# EAGLE design Ronin (EAGLE 8.3.1)

## Sheet 1 of 2
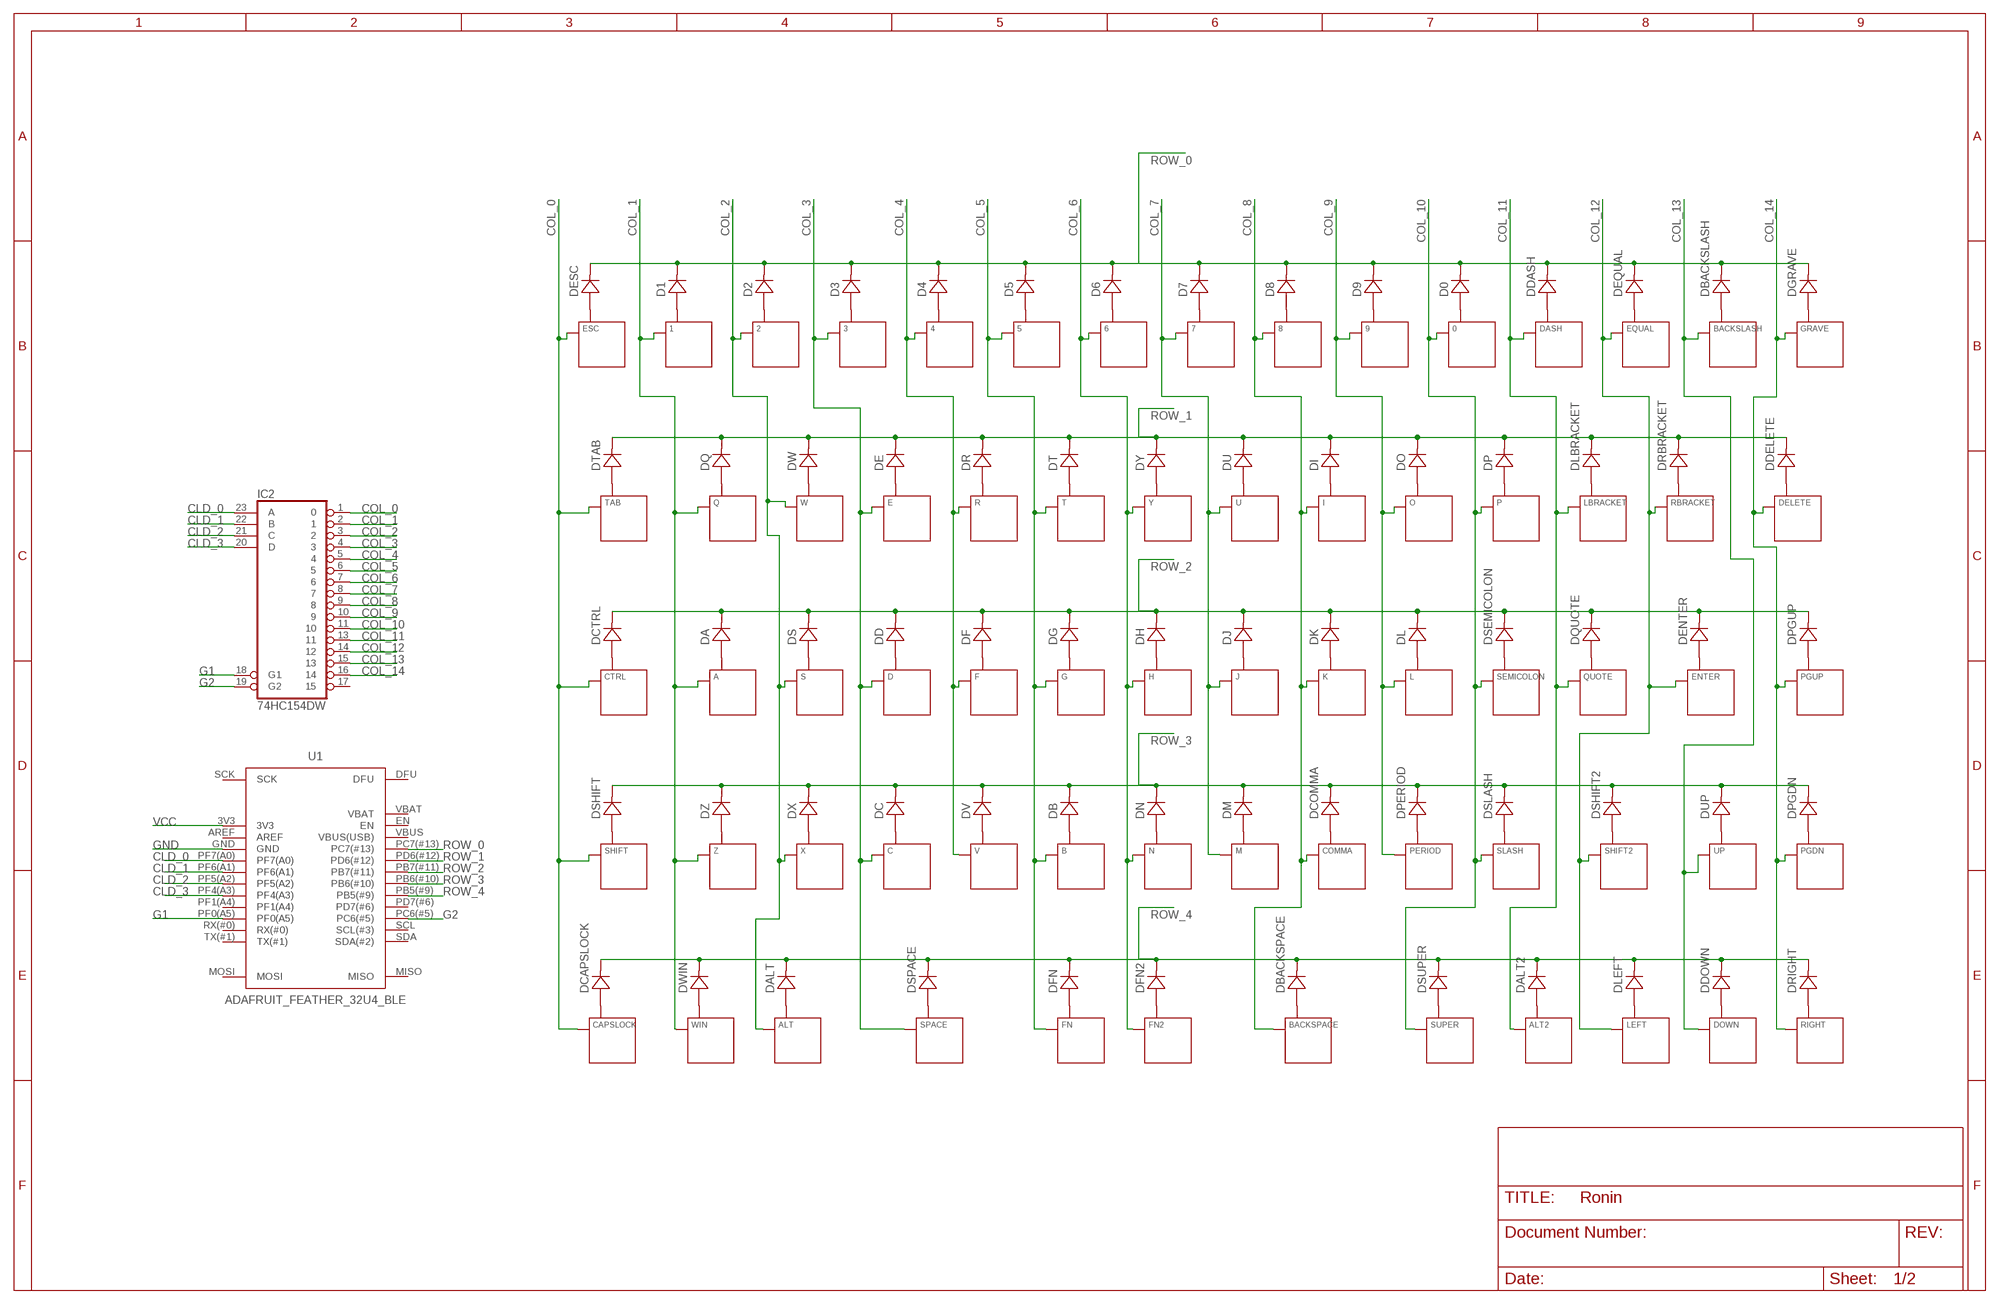
[diagram p0: schematic, sheet 1]

### Parts
0  KEYSWITCH-PLAIN-ALPSMX-1U  [ALPSMX-1U]
1  KEYSWITCH-PLAIN-ALPSMX-1U  [ALPSMX-1U]
2  KEYSWITCH-PLAIN-ALPSMX-1U  [ALPSMX-1U]
3  KEYSWITCH-PLAIN-ALPSMX-1U  [ALPSMX-1U]
4  KEYSWITCH-PLAIN-ALPSMX-1U  [ALPSMX-1U]
5  KEYSWITCH-PLAIN-ALPSMX-1U  [ALPSMX-1U]
6  KEYSWITCH-PLAIN-ALPSMX-1U  [ALPSMX-1U]
7  KEYSWITCH-PLAIN-ALPSMX-1U  [ALPSMX-1U]
8  KEYSWITCH-PLAIN-ALPSMX-1U  [ALPSMX-1U]
9  KEYSWITCH-PLAIN-ALPSMX-1U  [ALPSMX-1U]
A  KEYSWITCH-PLAIN-ALPSMX-1U  [ALPSMX-1U]
ALT  KEYSWITCH-PLAIN-ALPSMX-1U  [ALPSMX-1U]
ALT2  KEYSWITCH-PLAIN-ALPSMX-1U  [ALPSMX-1U]
B  KEYSWITCH-PLAIN-ALPSMX-1U  [ALPSMX-1U]
BACKSLASH  KEYSWITCH-PLAIN-ALPSMX-1U  [ALPSMX-1U]
BACKSPACE  KEYSWITCH-PLAIN-ALPSMX-2U  [ALPSMX-2U]
C  KEYSWITCH-PLAIN-ALPSMX-1U  [ALPSMX-1U]
CAPSLOCK  KEYSWITCH-PLAIN-ALPSMX-1U  [ALPSMX-1U]
COMMA  KEYSWITCH-PLAIN-ALPSMX-1U  [ALPSMX-1U]
CTRL  KEYSWITCH-PLAIN-ALPSMX-1U  [ALPSMX-1U]
D  KEYSWITCH-PLAIN-ALPSMX-1U  [ALPSMX-1U]
D0  DIODE-SOD-123  [SOD-123]
D1  DIODE-SOD-123  [SOD-123]
D2  DIODE-SOD-123  [SOD-123]
D3  DIODE-SOD-123  [SOD-123]
D4  DIODE-SOD-123  [SOD-123]
D5  DIODE-SOD-123  [SOD-123]
D6  DIODE-SOD-123  [SOD-123]
D7  DIODE-SOD-123  [SOD-123]
D8  DIODE-SOD-123  [SOD-123]
D9  DIODE-SOD-123  [SOD-123]
DA  DIODE-SOD-123  [SOD-123]
DALT  DIODE-SOD-123  [SOD-123]
DALT2  DIODE-SOD-123  [SOD-123]
DASH  KEYSWITCH-PLAIN-ALPSMX-1U  [ALPSMX-1U]
DB  DIODE-SOD-123  [SOD-123]
DBACKSLASH  DIODE-SOD-123  [SOD-123]
DBACKSPACE  DIODE-SOD-123  [SOD-123]
DC  DIODE-SOD-123  [SOD-123]
DCAPSLOCK  DIODE-SOD-123  [SOD-123]
DCOMMA  DIODE-SOD-123  [SOD-123]
DCTRL  DIODE-SOD-123  [SOD-123]
DD  DIODE-SOD-123  [SOD-123]
DDASH  DIODE-SOD-123  [SOD-123]
DDELETE  DIODE-SOD-123  [SOD-123]
DDOWN  DIODE-SOD-123  [SOD-123]
DE  DIODE-SOD-123  [SOD-123]
DELETE  KEYSWITCH-PLAIN-ALPSMX-1U  [ALPSMX-1U]
DENTER  DIODE-SOD-123  [SOD-123]
DEQUAL  DIODE-SOD-123  [SOD-123]
DESC  DIODE-SOD-123  [SOD-123]
DF  DIODE-SOD-123  [SOD-123]
DFN  DIODE-SOD-123  [SOD-123]
DFN2  DIODE-SOD-123  [SOD-123]
DG  DIODE-SOD-123  [SOD-123]
DGRAVE  DIODE-SOD-123  [SOD-123]
DH  DIODE-SOD-123  [SOD-123]
DI  DIODE-SOD-123  [SOD-123]
DJ  DIODE-SOD-123  [SOD-123]
DK  DIODE-SOD-123  [SOD-123]
DL  DIODE-SOD-123  [SOD-123]
DLBRACKET  DIODE-SOD-123  [SOD-123]
DLEFT  DIODE-SOD-123  [SOD-123]
DM  DIODE-SOD-123  [SOD-123]
DN  DIODE-SOD-123  [SOD-123]
DO  DIODE-SOD-123  [SOD-123]
DOWN  KEYSWITCH-PLAIN-ALPSMX-1U  [ALPSMX-1U]
DP  DIODE-SOD-123  [SOD-123]
DPERIOD  DIODE-SOD-123  [SOD-123]
DPGDN  DIODE-SOD-123  [SOD-123]
DPGUP  DIODE-SOD-123  [SOD-123]
DQ  DIODE-SOD-123  [SOD-123]
DQUOTE  DIODE-SOD-123  [SOD-123]
DR  DIODE-SOD-123  [SOD-123]
DRBRACKET  DIODE-SOD-123  [SOD-123]
DRIGHT  DIODE-SOD-123  [SOD-123]
DS  DIODE-SOD-123  [SOD-123]
DSEMICOLON  DIODE-SOD-123  [SOD-123]
DSHIFT  DIODE-SOD-123  [SOD-123]
DSHIFT2  DIODE-SOD-123  [SOD-123]
DSLASH  DIODE-SOD-123  [SOD-123]
DSPACE  DIODE-SOD-123  [SOD-123]
DSUPER  DIODE-SOD-123  [SOD-123]
DT  DIODE-SOD-123  [SOD-123]
DTAB  DIODE-SOD-123  [SOD-123]
DU  DIODE-SOD-123  [SOD-123]
DUP  DIODE-SOD-123  [SOD-123]
DV  DIODE-SOD-123  [SOD-123]
DW  DIODE-SOD-123  [SOD-123]
DWIN  DIODE-SOD-123  [SOD-123]
DX  DIODE-SOD-123  [SOD-123]
DY  DIODE-SOD-123  [SOD-123]
DZ  DIODE-SOD-123  [SOD-123]
E  KEYSWITCH-PLAIN-ALPSMX-1U  [ALPSMX-1U]
ENTER  KEYSWITCH-PLAIN-ALPSMX-1U  [ALPSMX-1U]
EQUAL  KEYSWITCH-PLAIN-ALPSMX-1U  [ALPSMX-1U]
ESC  KEYSWITCH-PLAIN-ALPSMX-1U  [ALPSMX-1U]
F  KEYSWITCH-PLAIN-ALPSMX-1U  [ALPSMX-1U]
FN  KEYSWITCH-PLAIN-ALPSMX-1U  [ALPSMX-1U]
FN2  KEYSWITCH-PLAIN-ALPSMX-1U  [ALPSMX-1U]
G  KEYSWITCH-PLAIN-ALPSMX-1U  [ALPSMX-1U]
GRAVE  KEYSWITCH-PLAIN-ALPSMX-1U  [ALPSMX-1U]
H  KEYSWITCH-PLAIN-ALPSMX-1U  [ALPSMX-1U]
I  KEYSWITCH-PLAIN-ALPSMX-1U  [ALPSMX-1U]
IC2  74HC154DW  [SO24W]
J  KEYSWITCH-PLAIN-ALPSMX-1U  [ALPSMX-1U]
K  KEYSWITCH-PLAIN-ALPSMX-1U  [ALPSMX-1U]
L  KEYSWITCH-PLAIN-ALPSMX-1U  [ALPSMX-1U]
LBRACKET  KEYSWITCH-PLAIN-ALPSMX-1U  [ALPSMX-1U]
LEFT  KEYSWITCH-PLAIN-ALPSMX-1U  [ALPSMX-1U]
M  KEYSWITCH-PLAIN-ALPSMX-1U  [ALPSMX-1U]
N  KEYSWITCH-PLAIN-ALPSMX-1U  [ALPSMX-1U]
O  KEYSWITCH-PLAIN-ALPSMX-1U  [ALPSMX-1U]
P  KEYSWITCH-PLAIN-ALPSMX-1U  [ALPSMX-1U]
PERIOD  KEYSWITCH-PLAIN-ALPSMX-1U  [ALPSMX-1U]
PGDN  KEYSWITCH-PLAIN-ALPSMX-1U  [ALPSMX-1U]
PGUP  KEYSWITCH-PLAIN-ALPSMX-1U  [ALPSMX-1U]
Q  KEYSWITCH-PLAIN-ALPSMX-1U  [ALPSMX-1U]
QUOTE  KEYSWITCH-PLAIN-ALPSMX-1U  [ALPSMX-1U]
R  KEYSWITCH-PLAIN-ALPSMX-1U  [ALPSMX-1U]
RBRACKET  KEYSWITCH-PLAIN-ALPSMX-1U  [ALPSMX-1U]
RIGHT  KEYSWITCH-PLAIN-ALPSMX-1U  [ALPSMX-1U]
S  KEYSWITCH-PLAIN-ALPSMX-1U  [ALPSMX-1U]
SEMICOLON  KEYSWITCH-PLAIN-ALPSMX-1U  [ALPSMX-1U]
SHIFT  KEYSWITCH-PLAIN-ALPSMX-1U  [ALPSMX-1U]
SHIFT2  KEYSWITCH-PLAIN-ALPSMX-1U  [ALPSMX-1U]
SLASH  KEYSWITCH-PLAIN-ALPSMX-1U  [ALPSMX-1U]
SPACE  KEYSWITCH-PLAIN-ALPSMX-2U  [ALPSMX-2U]
SUPER  KEYSWITCH-PLAIN-ALPSMX-1U  [ALPSMX-1U]
T  KEYSWITCH-PLAIN-ALPSMX-1U  [ALPSMX-1U]
TAB  KEYSWITCH-PLAIN-ALPSMX-1U  [ALPSMX-1U]
U  KEYSWITCH-PLAIN-ALPSMX-1U  [ALPSMX-1U]
U1  ADAFRUIT_FEATHER_32U4_BLE  [ADAFRUIT_FEATHER_32U4_BLUEFRUIT]
UP  KEYSWITCH-PLAIN-ALPSMX-1U  [ALPSMX-1U]
V  KEYSWITCH-PLAIN-ALPSMX-1U  [ALPSMX-1U]
W  KEYSWITCH-PLAIN-ALPSMX-1U  [ALPSMX-1U]
WIN  KEYSWITCH-PLAIN-ALPSMX-1U  [ALPSMX-1U]
X  KEYSWITCH-PLAIN-ALPSMX-1U  [ALPSMX-1U]
Y  KEYSWITCH-PLAIN-ALPSMX-1U  [ALPSMX-1U]
Z  KEYSWITCH-PLAIN-ALPSMX-1U  [ALPSMX-1U]

### Nets
CLD_0: IC2.23(A) U1.PF7(A0)
CLD_1: IC2.22(B) U1.PF6(A1)
CLD_2: IC2.21(C) U1.PF5(A2)
CLD_3: IC2.20(D) U1.PF4(A3)
COL_0: CAPSLOCK.ALPS1(P0) CAPSLOCK.MX1(P0) CTRL.ALPS1(P0) CTRL.MX1(P0) ESC.ALPS1(P0) ESC.MX1(P0) IC2.1 SHIFT.ALPS1(P0) SHIFT.MX1(P0) TAB.ALPS1(P0) TAB.MX1(P0)
COL_1: 1.ALPS1(P0) 1.MX1(P0) A.ALPS1(P0) A.MX1(P0) IC2.2 Q.ALPS1(P0) Q.MX1(P0) WIN.ALPS1(P0) WIN.MX1(P0) Z.ALPS1(P0) Z.MX1(P0)
COL_2: 2.ALPS1(P0) 2.MX1(P0) ALT.ALPS1(P0) ALT.MX1(P0) IC2.3 S.ALPS1(P0) S.MX1(P0) W.ALPS1(P0) W.MX1(P0) X.ALPS1(P0) X.MX1(P0)
COL_3: 3.ALPS1(P0) 3.MX1(P0) C.ALPS1(P0) C.MX1(P0) D.ALPS1(P0) D.MX1(P0) E.ALPS1(P0) E.MX1(P0) IC2.4 SPACE.ALPS1(P0) SPACE.MX1(P0)
COL_4: 4.ALPS1(P0) 4.MX1(P0) F.ALPS1(P0) F.MX1(P0) IC2.5 R.ALPS1(P0) R.MX1(P0) V.ALPS1(P0) V.MX1(P0)
COL_5: 5.ALPS1(P0) 5.MX1(P0) B.ALPS1(P0) B.MX1(P0) FN.ALPS1(P0) FN.MX1(P0) G.ALPS1(P0) G.MX1(P0) IC2.6 T.ALPS1(P0) T.MX1(P0)
COL_6: 6.ALPS1(P0) 6.MX1(P0) FN2.ALPS1(P0) FN2.MX1(P0) H.ALPS1(P0) H.MX1(P0) IC2.7 N.ALPS1(P0) N.MX1(P0) Y.ALPS1(P0) Y.MX1(P0)
COL_7: 7.ALPS1(P0) 7.MX1(P0) IC2.8 J.ALPS1(P0) J.MX1(P0) M.ALPS1(P0) M.MX1(P0) U.ALPS1(P0) U.MX1(P0)
COL_8: 8.ALPS1(P0) 8.MX1(P0) BACKSPACE.ALPS1(P0) BACKSPACE.MX1(P0) COMMA.ALPS1(P0) COMMA.MX1(P0) I.ALPS1(P0) I.MX1(P0) IC2.9 K.ALPS1(P0) K.MX1(P0)
COL_9: 9.ALPS1(P0) 9.MX1(P0) IC2.10 L.ALPS1(P0) L.MX1(P0) O.ALPS1(P0) O.MX1(P0) PERIOD.ALPS1(P0) PERIOD.MX1(P0)
COL_10: 0.ALPS1(P0) 0.MX1(P0) IC2.11 P.ALPS1(P0) P.MX1(P0) SEMICOLON.ALPS1(P0) SEMICOLON.MX1(P0) SLASH.ALPS1(P0) SLASH.MX1(P0) SUPER.ALPS1(P0) SUPER.MX1(P0)
COL_11: ALT2.ALPS1(P0) ALT2.MX1(P0) DASH.ALPS1(P0) DASH.MX1(P0) IC2.13 LBRACKET.ALPS1(P0) LBRACKET.MX1(P0) QUOTE.ALPS1(P0) QUOTE.MX1(P0)
COL_12: ENTER.ALPS1(P0) ENTER.MX1(P0) EQUAL.ALPS1(P0) EQUAL.MX1(P0) IC2.14 LEFT.ALPS1(P0) LEFT.MX1(P0) RBRACKET.ALPS1(P0) RBRACKET.MX1(P0) SHIFT2.ALPS1(P0) SHIFT2.MX1(P0)
COL_13: BACKSLASH.ALPS1(P0) BACKSLASH.MX1(P0) DOWN.ALPS1(P0) DOWN.MX1(P0) IC2.15 UP.ALPS1(P0) UP.MX1(P0)
COL_14: DELETE.ALPS1(P0) DELETE.MX1(P0) GRAVE.ALPS1(P0) GRAVE.MX1(P0) IC2.16 PGDN.ALPS1(P0) PGDN.MX1(P0) PGUP.ALPS1(P0) PGUP.MX1(P0) RIGHT.ALPS1(P0) RIGHT.MX1(P0)
G1: IC2.18(G1) U1.PF0(A5)
G2: IC2.19(G2) U1.PC6(#5)
GND: U1.GND
N$1: DESC.A ESC.ALPS2(P1) ESC.MX2(P1)
N$2: 1.ALPS2(P1) 1.MX2(P1) D1.A
N$3: 2.ALPS2(P1) 2.MX2(P1) D2.A
N$4: 3.ALPS2(P1) 3.MX2(P1) D3.A
N$5: 4.ALPS2(P1) 4.MX2(P1) D4.A
N$6: 5.ALPS2(P1) 5.MX2(P1) D5.A
N$7: 6.ALPS2(P1) 6.MX2(P1) D6.A
N$8: 7.ALPS2(P1) 7.MX2(P1) D7.A
N$9: 8.ALPS2(P1) 8.MX2(P1) D8.A
N$10: 9.ALPS2(P1) 9.MX2(P1) D9.A
N$11: 0.ALPS2(P1) 0.MX2(P1) D0.A
N$12: DASH.ALPS2(P1) DASH.MX2(P1) DDASH.A
N$13: DEQUAL.A EQUAL.ALPS2(P1) EQUAL.MX2(P1)
N$14: BACKSLASH.ALPS2(P1) BACKSLASH.MX2(P1) DBACKSLASH.A
N$15: DGRAVE.A GRAVE.ALPS2(P1) GRAVE.MX2(P1)
N$16: DTAB.A TAB.ALPS2(P1) TAB.MX2(P1)
N$17: DQ.A Q.ALPS2(P1) Q.MX2(P1)
N$18: DW.A W.ALPS2(P1) W.MX2(P1)
N$19: DE.A E.ALPS2(P1) E.MX2(P1)
N$20: DR.A R.ALPS2(P1) R.MX2(P1)
N$21: DT.A T.ALPS2(P1) T.MX2(P1)
N$22: DY.A Y.ALPS2(P1) Y.MX2(P1)
N$23: DU.A U.ALPS2(P1) U.MX2(P1)
N$24: DI.A I.ALPS2(P1) I.MX2(P1)
N$25: DO.A O.ALPS2(P1) O.MX2(P1)
N$26: DP.A P.ALPS2(P1) P.MX2(P1)
N$27: DLBRACKET.A LBRACKET.ALPS2(P1) LBRACKET.MX2(P1)
N$28: DRBRACKET.A RBRACKET.ALPS2(P1) RBRACKET.MX2(P1)
N$29: DDELETE.A DELETE.ALPS2(P1) DELETE.MX2(P1)
N$30: CTRL.ALPS2(P1) CTRL.MX2(P1) DCTRL.A
N$31: A.ALPS2(P1) A.MX2(P1) DA.A
N$32: DS.A S.ALPS2(P1) S.MX2(P1)
N$33: D.ALPS2(P1) D.MX2(P1) DD.A
N$34: DF.A F.ALPS2(P1) F.MX2(P1)
N$35: DG.A G.ALPS2(P1) G.MX2(P1)
N$36: DH.A H.ALPS2(P1) H.MX2(P1)
N$37: DJ.A J.ALPS2(P1) J.MX2(P1)
N$38: DK.A K.ALPS2(P1) K.MX2(P1)
N$39: DL.A L.ALPS2(P1) L.MX2(P1)
N$40: DSEMICOLON.A SEMICOLON.ALPS2(P1) SEMICOLON.MX2(P1)
N$41: DQUOTE.A QUOTE.ALPS2(P1) QUOTE.MX2(P1)
N$42: DENTER.A ENTER.ALPS2(P1) ENTER.MX2(P1)
N$43: DPGUP.A PGUP.ALPS2(P1) PGUP.MX2(P1)
N$44: DSHIFT.A SHIFT.ALPS2(P1) SHIFT.MX2(P1)
N$45: DZ.A Z.ALPS2(P1) Z.MX2(P1)
N$46: DX.A X.ALPS2(P1) X.MX2(P1)
N$47: C.ALPS2(P1) C.MX2(P1) DC.A
N$48: DV.A V.ALPS2(P1) V.MX2(P1)
N$49: B.ALPS2(P1) B.MX2(P1) DB.A
N$50: DN.A N.ALPS2(P1) N.MX2(P1)
N$51: DM.A M.ALPS2(P1) M.MX2(P1)
N$52: COMMA.ALPS2(P1) COMMA.MX2(P1) DCOMMA.A
N$53: DPERIOD.A PERIOD.ALPS2(P1) PERIOD.MX2(P1)
N$54: DSLASH.A SLASH.ALPS2(P1) SLASH.MX2(P1)
N$55: DSHIFT2.A SHIFT2.ALPS2(P1) SHIFT2.MX2(P1)
N$56: DUP.A UP.ALPS2(P1) UP.MX2(P1)
N$57: DPGDN.A PGDN.ALPS2(P1) PGDN.MX2(P1)
N$58: CAPSLOCK.ALPS2(P1) CAPSLOCK.MX2(P1) DCAPSLOCK.A
N$59: DWIN.A WIN.ALPS2(P1) WIN.MX2(P1)
N$60: ALT.ALPS2(P1) ALT.MX2(P1) DALT.A
N$61: DSPACE.A SPACE.ALPS2(P1) SPACE.MX2(P1)
N$62: DFN.A FN.ALPS2(P1) FN.MX2(P1)
N$63: DFN2.A FN2.ALPS2(P1) FN2.MX2(P1)
N$64: BACKSPACE.ALPS2(P1) BACKSPACE.MX2(P1) DBACKSPACE.A
N$65: DSUPER.A SUPER.ALPS2(P1) SUPER.MX2(P1)
N$66: ALT2.ALPS2(P1) ALT2.MX2(P1) DALT2.A
N$67: DLEFT.A LEFT.ALPS2(P1) LEFT.MX2(P1)
N$68: DDOWN.A DOWN.ALPS2(P1) DOWN.MX2(P1)
N$69: DRIGHT.A RIGHT.ALPS2(P1) RIGHT.MX2(P1)
ROW_0: D0.C D1.C D2.C D3.C D4.C D5.C D6.C D7.C D8.C D9.C DBACKSLASH.C DDASH.C DEQUAL.C DESC.C DGRAVE.C U1.PC7(#13)
ROW_1: DDELETE.C DE.C DI.C DLBRACKET.C DO.C DP.C DQ.C DR.C DRBRACKET.C DT.C DTAB.C DU.C DW.C DY.C U1.PD6(#12)
ROW_2: DA.C DCTRL.C DD.C DENTER.C DF.C DG.C DH.C DJ.C DK.C DL.C DPGUP.C DQUOTE.C DS.C DSEMICOLON.C U1.PB7(#11)
ROW_3: DB.C DC.C DCOMMA.C DM.C DN.C DPERIOD.C DPGDN.C DSHIFT2.C DSHIFT.C DSLASH.C DUP.C DV.C DX.C DZ.C U1.PB6(#10)
ROW_4: DALT2.C DALT.C DBACKSPACE.C DCAPSLOCK.C DDOWN.C DFN2.C DFN.C DLEFT.C DRIGHT.C DSPACE.C DSUPER.C DWIN.C U1.PB5(#9)
VCC: U1.3V3
Unconnected: IC2.17 U1.AREF U1.DFU U1.EN U1.MISO U1.MOSI U1.PD7(#6) U1.PF1(A4) U1.RX(#0) U1.SCK U1.SCL(SCL(#3)) U1.SDA(SDA(#2)) U1.TX(#1) U1.VBAT U1.VBUS(VBUS(USB))

## Sheet 2 of 2

## Power pins joined to a net without a drawn wire
GND: IC2.12(GND)
VCC: IC2.24(VCC)

## Library data of the parts
0 1-9 A ALT ALT2 B BACKSLASH BACKSPACE C CAPSLOCK COMMA CTRL D DASH DELETE DOWN E ENTER EQUAL ESC F FN FN2 G GRAVE H I J K L LBRACKET LEFT M N O P PERIOD PGDN PGUP Q QUOTE R RBRACKET RIGHT S SEMICOLON SHIFT SHIFT2 SLASH SPACE SUPER T TAB U UP V W WIN X Y Z = Keyboard:KEYSWITCH-PLAIN
D0 D1-D9 DA DALT DALT2 DB DBACKSLASH DBACKSPACE DC DCAPSLOCK DCOMMA DCTRL DD DDASH DDELETE DDOWN DE DENTER DEQUAL DESC DF DFN DFN2 DG DGRAVE DH DI DJ DK DL DLBRACKET DLEFT DM DN DO DP DPERIOD DPGDN DPGUP DQ DQUOTE DR DRBRACKET DRIGHT DS DSEMICOLON DSHIFT DSHIFT2 DSLASH DSPACE DSUPER DT DTAB DU DUP DV DW DWIN DX DY DZ = Controller:DIODE: Standard 1N4148 diode
IC2 = 74xx-eu:74*154: 4-line to 16-line data SELECTOR/MULTIPLEXER
U1 = Adafruit_Feather_32u4_Bluefruit:ADAFRUIT_FEATHER_32U4_BLE: Footprint for attaching the pins of Adafruit Feather 32u4 Bluefruit Module

## Board
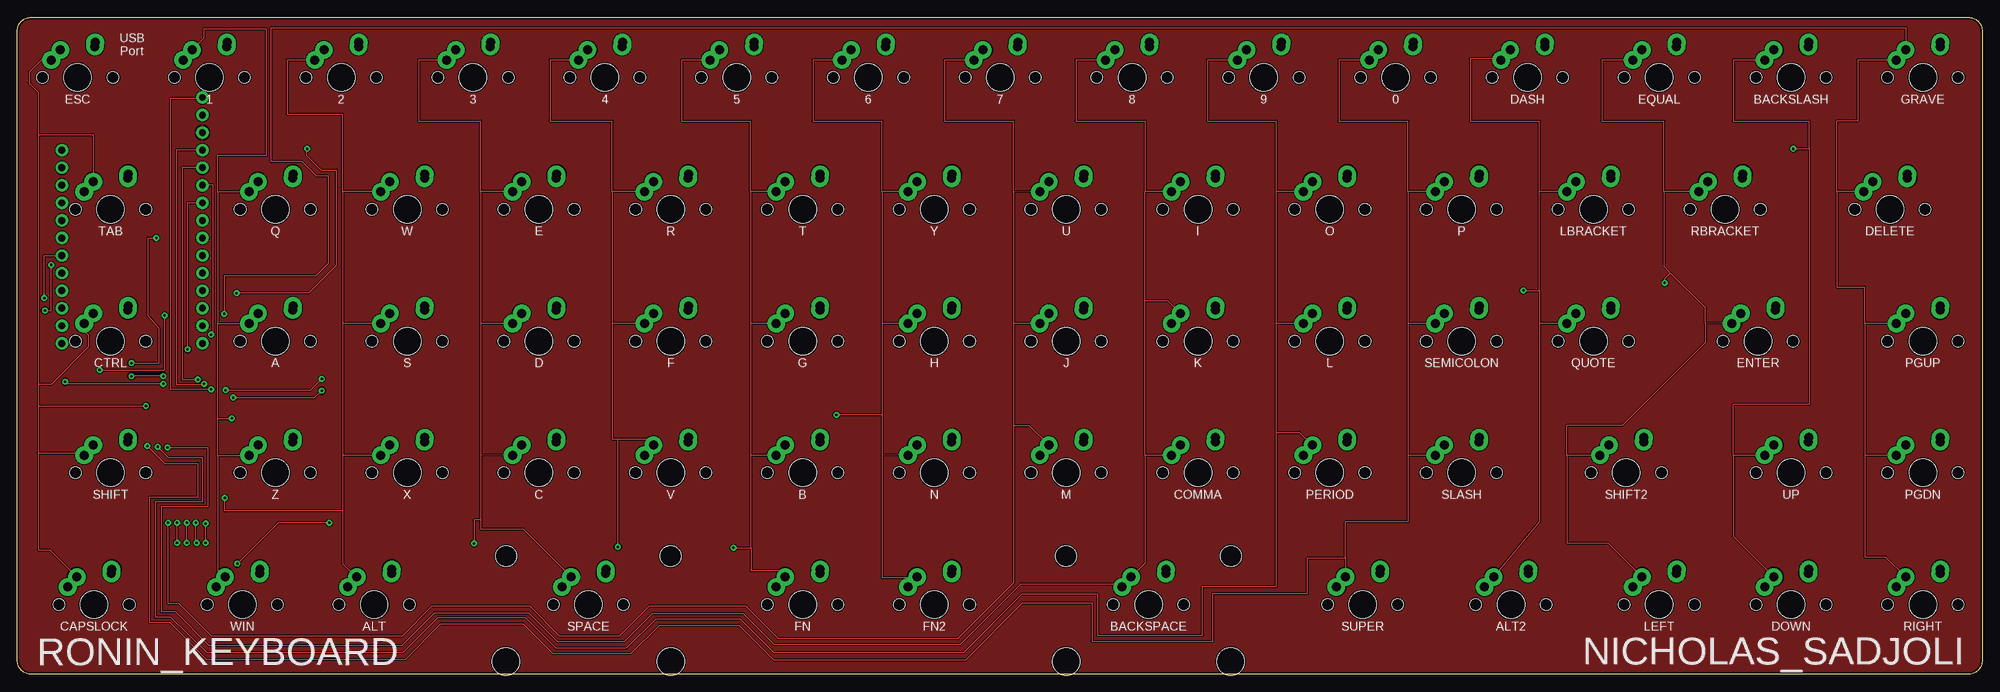
[diagram p1: board, top side]
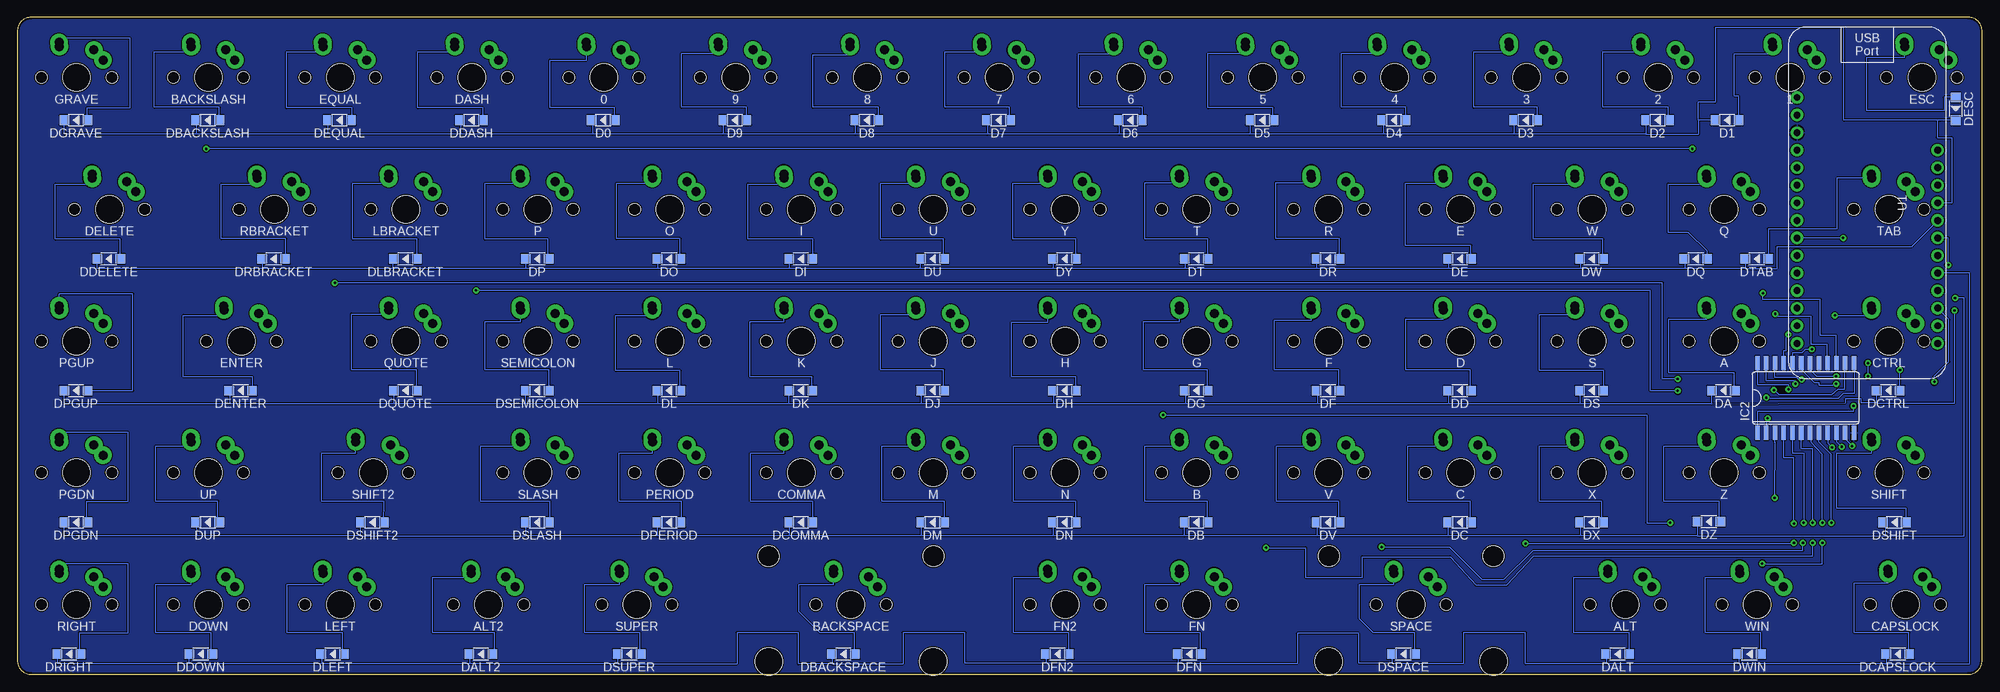
[diagram p2: board, bottom side, seen from below]

Size 284 x 95 mm. Coordinates in mm from the lower left corner, seen from the top.
Outline: 0,2 0,93 arc-90 2,95 282,95 arc-90 284,93 284,2 arc-90 282,0 2,0 arc-90 0,2
Copper layers (1*16): Top 0.035mm / dielectric 1.5mm / Bottom 0.035mm
Design rules "SparkFun *": minimum track width 8mil, minimum drill 20mil, track to track 6mil, track to pad 6mil, pad to pad 0mil, via to via 6mil, smd to smd 6mil, copper to edge 8mil, drill to drill 8mil, minimum pad ring 12mil, minimum via ring 10mil, stop-mask expansion 4mil, vias tented up to drill 20mil, thermal gap 10mil

### Footprints (pad centres in the part's own frame; a part is rotated, then mirrored left to right if it is on the bottom)
ALPSMX-1U = drill 1.3 pad 2.54: ALPS1 -2.5,4; ALPS2 2.5,4.5; MX1 -3.81,2.54; MX2 2.54,5.08 | hole 4: 0,0 | hole 1.7: -5.08,0; 5.08,0
ALPSMX-2U = drill 1.3 pad 2.54: ALPS1 -2.5,4; ALPS2 2.5,4.5; MX1 -3.81,2.54; MX2 2.54,5.08 | hole 4: 0,0; -11.9,-8.24; 11.9,-8.24 | hole 1.7: -5.08,0; 5.08,0 | hole 3.05: -11.9,7; 11.9,7
SOD-123 = smd 1.397 x 1.397: A -1.651,0; C 1.651,0
SO24W = smd 0.66 x 2.032: 1 -6.985,-5.029; 2 -5.715,-5.029; 3 -4.445,-5.029; 4 -3.175,-5.029; 5 -1.905,-5.029; 6 -0.635,-5.029; 7 0.635,-5.029; 8 1.905,-5.029; 9 3.175,-5.029; 10 4.445,-5.029; 11 5.715,-5.029; 12 6.985,-5.029; 13 6.985,5.029; 14 5.715,5.029; 15 4.445,5.029; 16 3.175,5.029; 17 1.905,5.029; 18 0.635,5.029; 19 -0.635,5.029; 20 -1.905,5.029; 21 -3.175,5.029; 22 -4.445,5.029; 23 -5.715,5.029; 24 -6.985,5.029
ADAFRUIT_FEATHER_32U4_BLUEFRUIT = drill 1 pad 1.778: 3V3 -10.16,15.24; AREF -10.16,12.7; DFU -10.16,-20.32; EN 10.16,5.08; GND -10.16,10.16; MISO -10.16,-12.7; MOSI -10.16,-10.16; PB5(#9) 10.16,-10.16; PB6(#10) 10.16,-7.62; PB7(#11) 10.16,-5.08; PC6(#5) 10.16,-15.24; PC7(#13) 10.16,0; PD6(#12) 10.16,-2.54; PD7(#6) 10.16,-12.7; PF0(A5) -10.16,-5.08; PF1(A4) -10.16,-2.54; PF4(A3) -10.16,0; PF5(A2) -10.16,2.54; PF6(A1) -10.16,5.08; PF7(A0) -10.16,7.62; RX(#0) -10.16,-15.24; SCK -10.16,-7.62; SCL 10.16,-17.78; SDA 10.16,-20.32; TX(#1) -10.16,-17.78; VBAT 10.16,7.62; VBUS 10.16,2.54

### Placement (x,y rotation side)
0  199.22,86.28 0 top
1  27.77,86.28 0 top
2  46.82,86.28 0 top
3  65.87,86.28 0 top
4  84.92,86.28 0 top
5  103.97,86.28 0 top
6  123.02,86.28 0 top
7  142.07,86.28 0 top
8  161.12,86.28 0 top
9  180.17,86.28 0 top
A  37.3,48.18 0 top
ALT  51.58,10.08 0 top
ALT2  215.89,10.08 0 top
B  113.5,29.13 0 top
BACKSLASH  256.37,86.28 0 top
BACKSPACE  163.5,10.08 0 top
C  75.4,29.13 0 top
CAPSLOCK  11.1,10.08 0 top
COMMA  170.65,29.13 0 top
CTRL  13.48,48.18 0 top
D  75.4,48.18 0 top
D0  199.33,80.12 180 bottom
D1  36.88,80.12 180 bottom
D2  46.93,80.12 180 bottom
D3  65.98,80.12 180 bottom
D4  85.03,80.12 180 bottom
D5  104.08,80.12 180 bottom
D6  123.13,80.12 180 bottom
D7  142.18,80.12 180 bottom
D8  161.23,80.12 180 bottom
D9  180.28,80.12 180 bottom
DA  37.41,41.02 180 bottom
DALT  52.69,2.92 180 bottom
DALT2  217,2.92 180 bottom
DASH  218.27,86.28 0 top
DB  113.61,21.97 180 bottom
DBACKSLASH  256.48,80.12 180 bottom
DBACKSPACE  164.61,2.92 180 bottom
DC  75.51,21.97 180 bottom
DCAPSLOCK  12.21,2.92 180 bottom
DCOMMA  170.76,21.97 180 bottom
DCTRL  13.59,41.02 180 bottom
DD  75.51,41.02 180 bottom
DDASH  218.38,80.12 180 bottom
DDELETE  270.77,60.07 180 bottom
DDOWN  257.48,2.92 180 bottom
DE  75.51,60.07 180 bottom
DELETE  270.66,67.23 0 top
DENTER  251.72,41.02 180 bottom
DEQUAL  237.43,80.12 180 bottom
DESC  3.82,81.77 270 bottom
DF  94.56,41.02 180 bottom
DFN  114.61,2.92 180 bottom
DFN2  133.66,2.92 180 bottom
DG  113.61,41.02 180 bottom
DGRAVE  275.53,80.12 180 bottom
DH  132.66,41.02 180 bottom
DI  170.76,60.07 180 bottom
DJ  151.71,41.02 180 bottom
DK  170.76,41.02 180 bottom
DL  189.81,41.02 180 bottom
DLBRACKET  227.91,60.07 180 bottom
DLEFT  238.43,2.92 180 bottom
DM  151.71,21.97 180 bottom
DN  132.66,21.97 180 bottom
DO  189.81,60.07 180 bottom
DOWN  256.37,10.08 0 top
DP  208.86,60.07 180 bottom
DPERIOD  189.81,21.97 180 bottom
DPGDN  275.53,21.97 180 bottom
DPGUP  275.53,41.02 180 bottom
DQ  41.41,60.07 180 bottom
DQUOTE  227.91,41.02 180 bottom
DR  94.56,60.07 180 bottom
DRBRACKET  246.96,60.07 180 bottom
DRIGHT  276.53,2.92 180 bottom
DS  56.46,41.02 180 bottom
DSEMICOLON  208.86,41.02 180 bottom
DSHIFT  12.69,21.97 180 bottom
DSHIFT2  232.67,21.97 180 bottom
DSLASH  208.86,21.97 180 bottom
DSPACE  83.65,2.92 180 bottom
DSUPER  195.57,2.92 180 bottom
DT  113.61,60.07 180 bottom
DTAB  32.59,60.07 180 bottom
DU  151.71,60.07 180 bottom
DUP  256.48,21.97 180 bottom
DV  94.56,21.97 180 bottom
DW  56.46,60.07 180 bottom
DWIN  33.64,2.92 180 bottom
DX  56.46,21.97 180 bottom
DY  132.66,60.07 180 bottom
DZ  39.51,22.07 180 bottom
E  75.4,67.23 0 top
ENTER  251.61,48.18 0 top
EQUAL  237.32,86.28 0 top
ESC  8.72,86.28 0 top
F  94.45,48.18 0 top
FN  113.5,10.08 0 top
FN2  132.55,10.08 0 top
G  113.5,48.18 0 top
GRAVE  275.42,86.28 0 top
H  132.55,48.18 0 top
I  170.65,67.23 0 top
IC2  25.51,39.96 0 bottom
J  151.6,48.18 0 top
K  170.65,48.18 0 top
L  189.7,48.18 0 top
LBRACKET  227.8,67.23 0 top
LEFT  237.32,10.08 0 top
M  151.6,29.13 0 top
N  132.55,29.13 0 top
O  189.7,67.23 0 top
P  208.75,67.23 0 top
PERIOD  189.7,29.13 0 top
PGDN  275.42,29.13 0 top
PGUP  275.42,48.18 0 top
Q  37.3,67.23 0 top
QUOTE  227.8,48.18 0 top
R  94.45,67.23 0 top
RBRACKET  246.85,67.23 0 top
RIGHT  275.42,10.08 0 top
S  56.35,48.18 0 top
SEMICOLON  208.75,48.18 0 top
SHIFT  13.48,29.13 0 top
SHIFT2  232.56,29.13 0 top
SLASH  208.75,29.13 0 top
SPACE  82.54,10.08 0 top
SUPER  194.46,10.08 0 top
T  113.5,67.23 0 top
TAB  13.48,67.23 0 top
U  151.6,67.23 0 top
U1  16.6,68.17 0 bottom
UP  256.37,29.13 0 top
V  94.45,29.13 0 top
W  56.35,67.23 0 top
WIN  32.53,10.08 0 top
X  56.35,29.13 0 top
Y  132.55,67.23 0 top
Z  37.3,29.13 0 top

### Tracks (layer width: path | path; a pad name or v marks a point on that pad's centre or on a via)
CLD_0  (via drill 0.35)
  Top 0.152: U1.PF7(A0) 23,75.79 23,41.9 27,41.9 v27,42
  Bottom 0.152: v27,42 27,42.4 31.23,42.4 IC2.23
CLD_1  (via drill 0.35)
  Top 0.152: U1.PF6(A1) 23.8,73.25 23.8,42.6 v26.1,42.6
  Bottom 0.152: v26.1,42.6 26.5,42.6 26.8,42.9 29.95,42.9 IC2.22
CLD_2  (via drill 0.35)
  Top 0.152: U1.PF5(A2) 28.3,70.7 28.3,49.4 v28,49.1
  Bottom 0.152: IC2.21 28.7,46.8 28.3,46.8 28.3,48.8 v28,49.1
CLD_3  (via drill 0.35)
  Top 0.152: v24.6,47 24.6,68.2 26.76,68.2 U1.PF4(A3)
  Bottom 0.152: IC2.20 27.4,44.99 27.4,46.5 26,46.5 25.5,47 v24.6,47
COL_0  (via drill 0.35)
  Top 0.152: ESC.ALPS1 6.22,90.13 ESC.MX1 3.43,88.82 1.7,87.08 1.7,85.48 3,84.17 3,78 | 3,78 3,42 | 3,42 3,38.8 | 3,38.8 3,32 | 3,32 3,18 4.68,18 CAPSLOCK.ALPS1 CAPSLOCK.MX1 | 3,78 10.98,78 TAB.ALPS1 TAB.MX1 | 3,42 4.97,42 10.34,47.38 10.34,48.98 9.67,49.66 CTRL.MX1 CTRL.ALPS1 | 3,32 9.67,32 SHIFT.MX1 SHIFT.ALPS1 | 3,38.8 v18.6,38.8
  Bottom 0.152: v18.6,38.8 18.6,38 32.49,38 IC2.1
COL_1  (via drill 0.35)
  Top 0.152: 1.MX1 1.ALPS1 27,92.01 27,93.33 36,93.33 36,75 29,75 29,69.77 | 29,69.77 29,50.7 | 29,31.66 29,37 | 29,37 29,50.7 | 29,31.66 29,15 WIN.ALPS1 WIN.MX1 | 29,50.7 A.MX1 A.ALPS1 | 29,31.66 Z.MX1 Z.ALPS1 | 29,69.77 Q.MX1 Q.ALPS1 | 29,37 v31,37
  Bottom 0.152: v31,37 31.23,37 IC2.2
COL_2  (via drill 0.35)
  Top 0.152: 2.ALPS1 2.MX1 39,88.82 39,81 47,81 47,69.78 | 47,50.74 47,31.67 | 47,69.78 47,50.74 | 47,31.67 47,23.6 | 47,23.6 47,16 48.92,14.08 ALT.ALPS1 ALT.MX1 | X.ALPS1 X.MX1 47,31.67 | S.ALPS1 S.MX1 47,50.74 | W.ALPS1 W.MX1 47,69.78 | 47,23.6 30,23.6 v30,25.5
  Bottom 0.152: v30,25.5 29.9,33.5 29.95,33.5 IC2.3
COL_3  (via drill 0.35)
  Top 0.152: 3.ALPS1 3.MX1 58,88.82 58,80 67,80 67,69.78 | 67,50.72 67,31.69 | 67,69.78 67,50.72 | 67,31.69 67,22.3 | 67,22.3 67,21 73.12,21 SPACE.ALPS1 SPACE.MX1 | C.ALPS1 C.MX1 67,31.69 | D.ALPS1 D.MX1 67,50.72 | E.ALPS1 E.MX1 67,69.78 | 67,22.3 66,22.3 v66,18.9 | v27.2,19 v27.2,21.8
  Bottom 0.152: v66,18.9 27.2,18.9 v27.2,19 | v27.2,21.8 27.2,31.3 28.68,31.3 IC2.4
COL_4  (via drill 0.35)
  Top 0.152: 4.ALPS1 4.MX1 77,88.82 77,80 86,80 86,69.77 | 86.8,34 86,34 86,50.74 | 86.8,34 91.08,34 V.ALPS1 V.MX1 | 86,69.77 86,50.74 | F.ALPS1 F.MX1 86,50.74 | R.ALPS1 R.MX1 86,69.77 | 86.8,34 v86.8,18.4 | 25.7,19 25.8,19 | v25.9,19 25.8,19 | 25.8,19 v25.8,21.9
  Bottom 0.152: v86.8,18.4 77,18.4 72.3,13.7 69.1,13.7 64.9,17.9 25.9,17.9 v25.9,19 | IC2.5 27.41,32 25.8,32 v25.8,21.9
COL_5  (via drill 0.35)
  Top 0.152: 106,50.72 106,31.64 | 106,69.79 106,50.72 | 106,69.79 106,80 96,80 96,88.82 5.MX1 5.ALPS1 | 106.02,15 106,15 | 106.02,15 110.08,15 FN.ALPS1 FN.MX1 | B.ALPS1 B.MX1 106,31.64 | G.ALPS1 G.MX1 106,50.72 | T.ALPS1 T.MX1 106,69.79 | v103.5,18.3 106,18.3 | v24.5,19 v24.5,21.9 | 106,31.64 106,18.3 | 106,18.3 106.02,18.3 106.02,15
  Bottom 0.152: v103.5,18.3 97.8,18.3 97.8,14 89.6,14 89.6,17 76.9,17 73.2,12.9 68.7,12.9 64.8,17.1 24.5,17.1 v24.5,19 | v24.5,21.9 24.5,32.6 26.14,32.6 IC2.6
COL_6  (via drill 0.35)
  Top 0.152: 125,69.77 125,50.74 | 125,69.77 125,80 115,80 115,88.82 6.MX1 6.ALPS1 | 125,31.69 125,14 129.97,14 FN2.ALPS1 FN2.MX1 | N.ALPS1 N.MX1 125,31.69 | H.ALPS1 H.MX1 125,50.74 | Y.ALPS1 Y.MX1 125,69.77 | 125,37.6 118.4,37.6 v118.4,37.5 | v45.1,21.9 37.7,21.9 v31.8,16 | v23.1,19 v23.1,21.9 | 125,50.74 125,37.6 | 125,37.6 125,31.69
  Bottom 0.152: v118.4,37.5 48.5,37.5 48.5,21.9 v45.1,21.9 | v31.8,16 23.1,16 v23.1,19 | v23.1,21.9 23.1,31.8 24.7,33.5 24.7,34.76 IC2.7
COL_7  (via drill 0.35)
  Top 0.152: 144,69.75 144,50.72 | 144,69.75 144,80 134,80 134,88.82 7.MX1 7.ALPS1 | 144,50.72 144,36 | 144,36 146.23,36 M.ALPS1 M.MX1 | J.ALPS1 J.MX1 144,50.72 | U.ALPS1 U.MX1 144,69.75 | 144,36 144,13.2 135.9,5.1 110,5.1 105.3,9.8 91.3,9.8 87,5.5 78.4,5.5 74.1,9.8 59.9,9.8 55.6,5.5 28.1,5.5 23.4,10.2 21.8,10.2 v21.8,21.9
  Bottom 0.152: v21.8,21.9 21.8,31.8 23.6,33.6 IC2.8
COL_8  (via drill 0.35)
  Top 0.152: 163,69.77 163,80 153,80 153,88.82 8.MX1 8.ALPS1 | K.MX1 K.ALPS1 166.33,54 163,53.99 | I.ALPS1 I.MX1 163,69.77 | 163,53.99 163,69.77 | 163,31.67 163,53.99 | 163,31.67 163,16 162.92,16 BACKSPACE.ALPS1 BACKSPACE.MX1 159.69,13.1 145.1,13.1 136.3,4.3 109.4,4.3 104.9,8.8 91.8,8.8 87.8,4.8 78,4.8 73.9,8.9 60.3,8.9 55.6,4.2 27.7,4.2 22.8,9.1 20.8,9.1 20.8,24.2 27.5,24.2 27.5,32.8 v21.7,32.8 | COMMA.ALPS1 COMMA.MX1 163,31.67
  Bottom 0.152: IC2.9 22.34,33.44 v21.7,32.8
COL_9  (via drill 0.35)
  Top 0.152: 182,69.76 182,80 172,80 172,88.82 9.MX1 9.ALPS1 | 182,50.71 182,69.76 | 182,35 182,50.71 | 182,35 185.33,35 PERIOD.ALPS1 PERIOD.MX1 | L.ALPS1 L.MX1 182,50.71 | O.ALPS1 O.MX1 182,69.76 | 182,35 182,12.7 171.3,12.7 171.3,5.6 156.1,5.6 156.1,11.6 145.2,11.6 136.8,3.2 109.3,3.2 104.5,8 92.3,8 88.1,3.8 77.8,3.8 73.4,8.2 60.8,8.2 55.8,3.2 27.4,3.2 22.1,8.3 19.9,8.3 19.9,24.9 26.8,24.9 26.8,31.3 21.9,31.3 v20.3,32.9
  Bottom 0.152: IC2.10 21.07,33.66 v20.3,32.9
COL_10  (via drill 0.35)
  Top 0.152: 201,50.71 201,31.67 | 201,69.76 201,50.71 | 201,69.76 201,80 191,80 191,88.82 0.MX1 0.ALPS1 | 201,31.67 201,22 191.96,22 191.96,16.89 | 191.96,16.89 SUPER.ALPS1 SUPER.MX1 | SLASH.ALPS1 SLASH.MX1 201,31.67 | SEMICOLON.ALPS1 SEMICOLON.MX1 201,50.71 | P.ALPS1 P.MX1 201,69.76 | v18.8,33 21.3,30.5 26.1,30.5 26.1,25.6 19.1,25.6 19.1,7.5 22,7.5 27.3,2.2 56.1,2.2 61.2,7.3 73.1,7.3 77.4,3 88.7,3 92.8,7.1 104.3,7.1 109.3,2.1 137.1,2.1 145.3,10.3 155.3,10.3 155.3,4.8 172.8,4.8 172.8,11.7 186.5,11.7 186.5,16.8 191.96,16.8 191.96,16.89
  Bottom 0.152: IC2.11 19.8,33.99 v18.8,33
COL_11  (via drill 0.35)
  Top 0.152: DASH.ALPS1 DASH.MX1 214.46,89 210,89 210,80 220,80 220,69.79 | 220,55.5 220,69.79 | 220,55.5 220,50.74 | 220,50.74 220,22 ALT2.ALPS1 ALT2.MX1 | QUOTE.ALPS1 QUOTE.MX1 220,50.74 | LBRACKET.ALPS1 LBRACKET.MX1 220,69.79 | v31.2,40 43,40 v44,41 | v217.7,55.5 220,55.5
  Bottom 0.152: v31.2,40 31.2,39.9 20.8,39.9 20.1,40.6 18.5,40.6 18.5,44.99 IC2.13 | v44,41 48,41 48,55.5 v217.7,55.5
COL_12  (via drill 0.35)
  Top 0.152: EQUAL.ALPS1 EQUAL.MX1 229,88.82 229,80 238,80 238,69.76 | 238.96,58.04 238,59 238,69.76 | 238.96,58.04 244,53 244,50.76 | 244,50.76 244,48 232,36 224,36 224,31.67 | 224,31.67 224,19 229.9,19 LEFT.ALPS1 LEFT.MX1 | SHIFT2.ALPS1 SHIFT2.MX1 224,31.67 | ENTER.ALPS1 ENTER.MX1 244,50.76 | RBRACKET.ALPS1 RBRACKET.MX1 238,69.76 | v30.1,41.1 42.4,41.1 v44,42.7 | v238.1,56.6 238.1,57.19 238.96,58.04
  Bottom 0.152: IC2.14 19.9,44.99 19.9,41.2 20.9,41.2 21.8,40.4 29.3,40.4 v30.1,41.1 30.1,41.3 | v44,42.7 46.2,42.7 46.2,56.6 v238.1,56.6
COL_13  (via drill 0.35)
  Top 0.152: 248,31.67 248,39 259,39 259,76 | 248,31.67 248,19.95 DOWN.ALPS1 DOWN.MX1 | 259,76 259,80 248,80 248,88.82 BACKSLASH.MX1 BACKSLASH.ALPS1 | UP.ALPS1 UP.MX1 248,31.67 | v41.9,76 41.8,75.9 41.8,75 43.9,72.9 46.1,72.9 46.1,59.1 42.1,55.1 v31.7,55.1 | v256.7,76 259,76
  Bottom 0.152: v41.9,76 v256.7,76 | IC2.15 21.1,44.99 21.1,49 23.4,49 23.4,54.2 31.7,54.2 v31.7,55.1
COL_14  (via drill 0.35)
  Top 0.152: 271.38,88.82 GRAVE.MX1 | 271.38,88.82 266,88.82 266,80 263,80 263,69.76 | 263,69.76 263,56 267,56 267,50.71 | 267,50.71 267,31.67 | 267,31.67 267,17 270,17 RIGHT.ALPS1 RIGHT.MX1 | PGDN.ALPS1 PGDN.MX1 267,31.67 | PGUP.ALPS1 PGUP.MX1 267,50.71 | DELETE.ALPS1 DELETE.MX1 263,69.76 | 271.38,88.82 GRAVE.ALPS1 272.92,93.5 36.7,93.5 36.7,74.1 41.2,74.1 43.2,72.1 44.9,72.1 44.9,59.4 43.1,57.6 29.9,57.6 v29.9,52.1
  Bottom 0.152: IC2.16 22.4,44.99 22.4,47.7 24.7,47.7 24.7,51.7 29.9,51.7 v29.9,52.1
G1  (via drill 0.35)
  Top 0.152: v21.1,43.1 v16.5,43.1 | v16.5,45 20.5,45 20.5,50 18.9,51.8 18.9,63.1 v20.1,63.1
  Bottom 0.152: IC2.18 24.88,43.98 24,43.1 v21.1,43.1 | v16.5,43.1 v16.5,45 | v20.1,63.1 v20.1,63.09 U1.PF0(A5)
G2  (via drill 0.35)
  Top 0.152: v21.1,42 7.3,42 v6.9,42.3
  Bottom 0.152: IC2.19 26.14,44.05 24.3,42.2 23.6,42.2 23.6,41.8 21.3,41.8 v21.1,42 | v6.9,42.3 6.9,43.1 4.8,45.2 4.8,51.29 U1.PC6(#5)
GND
  pour Top (isolate 0.006): 0,2 0,93 arc-90 2,95 282,95 arc-90 284,93 284,2 arc-90 282,0 2,0 arc-90
  pour Bottom (isolate 0.006): 0,2 0,93 arc-90 2,95 282,95 arc-90 284,93 284,2 arc-90 282,0 2,0 arc-90
N$1
  Bottom 0.152: DESC.A 5.5,83.42 5.5,81.5 16.7,81.5 16.7,89.2 11.22,89.2 ESC.ALPS2 11.26,90.78 ESC.MX2
N$2
  Bottom 0.152: D1.A 35.2,80.12 35.2,83.6 35.8,83.6 35.8,89.7 30.27,89.7 1.ALPS2 30.31,90.78 1.MX2
N$3
  Bottom 0.152: D2.A 45.4,80.12 45.4,82 54.8,82 54.8,90 49.32,90 2.ALPS2 49.36,90.78 2.MX2
N$4
  Bottom 0.152: D3.A 64.3,80.12 64.3,82 73.5,82 73.5,90 68.37,90 3.ALPS2 68.41,90.78 3.MX2
N$5
  Bottom 0.152: D4.A 83.3,80.12 83.3,82 92.6,82 92.6,89.8 87.42,89.8 4.ALPS2 87.46,90.78 4.MX2
N$6
  Bottom 0.152: D5.A 102.5,80.12 102.5,81.9 111.9,81.9 111.9,89.8 106.47,89.8 5.ALPS2 106.51,90.78 5.MX2
N$7
  Bottom 0.152: D6.A 121.4,80.12 121.4,82 130.6,82 130.6,89.7 125.52,89.7 6.ALPS2 125.56,90.78 6.MX2
N$8
  Bottom 0.152: D7.A 140.6,80.12 140.6,82 149.9,82 149.9,90 144.57,90 7.ALPS2 144.61,90.78 7.MX2
N$9
  Bottom 0.152: D8.A 159.5,80.12 159.5,82 169,82 169,89.6 163.62,89.6 8.ALPS2 163.66,90.78 8.MX2
N$10
  Bottom 0.152: D9.A 178.6,80.12 178.6,82 188,82 188,89.8 182.67,89.8 9.ALPS2 182.71,90.78 9.MX2
N$11
  Bottom 0.152: D0.A 197.7,80.12 197.7,81.9 207,81.9 207,88.8 201.72,88.8 0.ALPS2 201.76,90.78 0.MX2
N$12
  Bottom 0.152: DDASH.A 216.7,80.12 216.7,81.9 226.1,81.9 226.1,90 220.77,90 DASH.ALPS2 220.81,90.78 DASH.MX2
N$13
  Bottom 0.152: DEQUAL.A 235.6,80.12 235.6,81.9 245.1,81.9 245.1,90 239.82,90 EQUAL.ALPS2 239.86,90.78 EQUAL.MX2
N$14
  Bottom 0.152: DBACKSLASH.A 254.8,80.12 254.8,82 264.2,82 264.2,90 258.87,90 BACKSLASH.ALPS2 258.91,90.78 BACKSLASH.MX2
N$15
  Bottom 0.152: DGRAVE.A 273.9,80.12 273.9,81.9 267.7,81.9 267.7,92 277.96,92 GRAVE.MX2 277.96,90.78 GRAVE.ALPS2
N$16
  Bottom 0.152: TAB.MX2 16.02,71.73 TAB.ALPS2 21,71.73 21,64.4 30.94,64.4 DTAB.A
N$17
  Bottom 0.152: DQ.A 39.76,61.16 42.5,63.9 45.4,63.9 45.4,70.9 39.8,70.9 Q.ALPS2 39.84,71.73 Q.MX2
N$18
  Bottom 0.152: DW.A 54.8,62.9 64.9,62.9 64.9,70.9 58.85,70.9 W.ALPS2 58.89,71.73 W.MX2
N$19
  Bottom 0.152: DE.A 73.9,60.07 73.9,62 83.4,62 83.4,71 77.9,71 E.ALPS2 77.94,71.73 E.MX2
N$20
  Bottom 0.152: DR.A 92.9,63 102.1,63 102.1,71.1 96.95,71.1 R.ALPS2 96.99,71.73 R.MX2
N$21
  Bottom 0.152: DT.A 111.9,60.07 111.9,62.9 121,62.9 121,71.1 116,71.1 T.ALPS2 116.04,71.73 T.MX2
N$22
  Bottom 0.152: DY.A 131,62.9 140.1,62.9 140.1,71 135.05,71 Y.ALPS2 135.09,71.73 Y.MX2
N$23
  Bottom 0.152: DU.A 150.1,60.07 150.1,62.9 159.2,62.9 159.2,71 154.1,71 U.ALPS2 154.14,71.73 U.MX2
N$24
  Bottom 0.152: DI.A 169,60.07 169,62.9 178.4,62.9 178.4,70.9 173.15,70.9 I.ALPS2 173.19,71.73 I.MX2
N$25
  Bottom 0.152: DO.A 188.2,60.07 188.2,63 197.4,63 197.4,71 192.2,71 O.ALPS2 192.24,71.73 O.MX2
N$26
  Bottom 0.152: DP.A 207.3,60.07 207.3,62.9 216.4,62.9 216.4,71 211.25,71 P.ALPS2 211.29,71.73 P.MX2
N$27
  Bottom 0.152: DLBRACKET.A 226.2,60.07 226.2,62.9 235.5,62.9 235.5,71 230.3,71 LBRACKET.ALPS2 230.34,71.73 LBRACKET.MX2
N$28
  Bottom 0.152: DRBRACKET.A 245.2,60.07 245.2,63 254.5,63 254.5,70.9 249.35,70.9 RBRACKET.ALPS2 249.39,71.73 RBRACKET.MX2
N$29
  Bottom 0.152: DDELETE.A 269.1,60.07 269.1,62.9 278.5,62.9 278.5,70.9 273.16,70.9 DELETE.ALPS2 273.2,71.73 DELETE.MX2
N$30  (via drill 0.35)
  Top 0.152: v11.9,44 21.3,44 v21.3,51.9
  Bottom 0.152: DCTRL.A 11.9,41.02 v11.9,44 | v21.3,51.9 15.98,51.9 CTRL.ALPS2 16.02,52.68 CTRL.MX2
N$31
  Bottom 0.152: DA.A 35.8,41.02 35.8,43.6 45.3,43.6 45.3,51.4 39.8,51.4 A.ALPS2 39.84,52.68 A.MX2
N$32
  Bottom 0.152: DS.A 54.7,41.02 54.7,43.9 64,43.9 64,52 58.85,52 S.ALPS2 58.89,52.68 S.MX2
N$33
  Bottom 0.152: DD.A 74,41.02 74,44 83.3,44 83.3,51.4 77.9,51.4 D.ALPS2 77.94,52.68 D.MX2
N$34
  Bottom 0.152: DF.A 93,41.02 93,44 102.3,44 102.3,51.2 96.95,51.2 F.ALPS2 96.99,52.68 F.MX2
N$35
  Bottom 0.152: DG.A 112,41.02 112,44 121.2,44 121.2,51 116,51 G.ALPS2 116.04,52.68 G.MX2
N$36
  Bottom 0.152: DH.A 131,43 140.3,43 140.3,50.9 135.05,50.9 H.ALPS2 135.09,52.68 H.MX2
N$37
  Bottom 0.152: DJ.A 150.1,41.02 150.1,44 159.2,44 159.2,52 154.1,52 J.ALPS2 154.14,52.68 J.MX2
N$38
  Bottom 0.152: DK.A 169.1,43 178.1,43 178.1,51 173.15,51 K.ALPS2 173.19,52.68 K.MX2
N$39
  Bottom 0.152: DL.A 188.2,41.02 188.2,43.9 197.5,43.9 197.5,51.9 192.2,51.9 L.ALPS2 192.24,52.68 L.MX2
N$40
  Bottom 0.152: DSEMICOLON.A 207.1,41.02 207.1,44 216.4,44 216.4,51 211.25,51 SEMICOLON.ALPS2 211.29,52.68 SEMICOLON.MX2
N$41
  Bottom 0.152: DQUOTE.A 226.3,41.02 226.3,44 235.7,44 235.7,52.1 230.3,52.1 QUOTE.ALPS2 230.34,52.68 QUOTE.MX2
N$42
  Bottom 0.152: DENTER.A 250,41.02 250,43 260,43 260,51.9 254.11,51.9 ENTER.ALPS2 254.15,52.68 ENTER.MX2
N$43
  Bottom 0.152: DPGUP.A 267.3,41.02 267.3,55 277.96,55 PGUP.MX2 277.96,52.68 PGUP.ALPS2
N$44
  Bottom 0.152: DSHIFT.A 11,21.97 11,24 21,24 21,32 15.98,32 SHIFT.ALPS2 SHIFT.MX2
N$45
  Bottom 0.152: DZ.A 38,22.07 38,25 46,25 46,33 39.8,33 Z.ALPS2 Z.MX2
N$46
  Bottom 0.152: DX.A 55,21.97 55,25 64,25 64,33 58.85,33 X.ALPS2 X.MX2
N$47
  Bottom 0.152: DC.A 74,21.97 74,25 83,25 83,33 77.9,33 C.ALPS2 C.MX2
N$48
  Bottom 0.152: DV.A 93,21.97 93,25 102,25 102,33 96.95,33 V.ALPS2 V.MX2
N$49
  Bottom 0.152: DB.A 112,21.97 112,25 121,25 121,33 116,33 B.ALPS2 B.MX2
N$50
  Bottom 0.152: DN.A 131,25 140,25 140,33 135.05,33 N.ALPS2 N.MX2
N$51
  Bottom 0.152: DM.A 150,21.97 150,25 159,25 159,33 154.1,33 M.ALPS2 M.MX2
N$52
  Bottom 0.152: DCOMMA.A 169,21.97 169,25 178,25 178,32 173.15,32 COMMA.ALPS2 COMMA.MX2
N$53
  Bottom 0.152: DPERIOD.A 188,21.97 188,25 197,25 197,32 192.2,32 PERIOD.ALPS2 PERIOD.MX2
N$54
  Bottom 0.152: DSLASH.A 207,21.97 207,25 217,25 217,33 211.25,33 SLASH.ALPS2 SLASH.MX2
N$55
  Bottom 0.152: DSHIFT2.A 231,25 240,25 240,32 235.06,32 SHIFT2.ALPS2 SHIFT2.MX2
N$56
  Bottom 0.152: DUP.A 255,21.97 255,25 264,25 264,33 258.87,33 UP.ALPS2 UP.MX2
N$57
  Bottom 0.152: DPGDN.A 274,21.97 274,25 268,25 268,35 277.96,35 PGDN.MX2 PGDN.ALPS2
N$58
  Bottom 0.152: DCAPSLOCK.A 10.6,2.92 10.6,6 18.5,6 18.5,13.2 13.6,13.2 CAPSLOCK.ALPS2 13.64,14.58 CAPSLOCK.MX2
N$59
  Bottom 0.152: DWIN.A 32,6 40,6 40,14 35.03,14 WIN.ALPS2 35.07,14.58 WIN.MX2
N$60
  Bottom 0.152: DALT.A 51,2.92 51,6 59,6 59,14 54.08,14 ALT.ALPS2 54.12,14.58 ALT.MX2
N$61
  Bottom 0.152: DSPACE.A 82,6 88,6 90,8 90,13 85.04,13 SPACE.ALPS2 85.08,14.58 SPACE.MX2
N$62
  Bottom 0.152: DFN.A 113,2.92 113,6 121,6 121,13 116,13 FN.ALPS2 116.04,14.58 FN.MX2
N$63
  Bottom 0.152: DFN2.A 132,6 140,6 140,14 135.05,14 FN2.ALPS2 135.09,14.58 FN2.MX2
N$64
  Bottom 0.152: DBACKSPACE.A 163,2.92 163,6 168,6 171,9 171,13 166,13 BACKSPACE.ALPS2 166.04,14.58 BACKSPACE.MX2
N$65
  Bottom 0.152: DSUPER.A 194,2.92 194,6 202,6 202,13 196.96,13 SUPER.ALPS2 197,14.58 SUPER.MX2
N$66
  Bottom 0.152: DALT2.A 215,2.92 215,6 224,6 224,14 218.39,14 ALT2.ALPS2 218.43,14.58 ALT2.MX2
N$67
  Bottom 0.152: DLEFT.A 237,2.92 237,6 245,6 245,13 239.82,13 LEFT.ALPS2 239.86,14.58 LEFT.MX2
N$68
  Bottom 0.152: DDOWN.A 256,2.92 256,6 264,6 264,13 258.87,13 DOWN.ALPS2 258.91,14.58 DOWN.MX2
N$69
  Bottom 0.152: DRIGHT.A 275,2.92 275,6 268,6 268,16 277.96,16 RIGHT.MX2 277.96,14.58 RIGHT.ALPS2
ROW_0
  Bottom 0.152: DESC.C 6.1,80.12 | 6.1,80.12 20,80.12 20,93.5 38.6,93.5 38.6,82.7 41,82.7 41,80.11 | 41,80.11 41,78.1 48.61,78.1 | 239.14,78.1 258.14,78.1 | 219.96,78.1 239.14,78.1 | 200.86,78.1 219.96,78.1 | 182.02,78.1 200.86,78.1 | 162.91,78.1 182.02,78.1 | 143.8,78.1 162.91,78.1 | 124.76,78.1 143.8,78.1 | 105.87,78.1 124.76,78.1 | 86.52,78.1 105.87,78.1 | 67.68,78.1 86.52,78.1 | 48.61,78.1 67.68,78.1 | 258.14,78.1 277.18,78.1 DGRAVE.C | DBACKSLASH.C 258.14,78.1 | DEQUAL.C 239.14,80.12 239.14,78.1 | DDASH.C 219.96,80.12 219.96,78.1 | D0.C 200.86,80.12 200.86,78.1 | D9.C 182.02,80.12 182.02,78.1 | D8.C 162.91,80.12 162.91,78.1 | D7.C 143.8,80.12 143.8,78.1 | D6.C 124.76,80.12 124.76,78.1 | D5.C 105.87,80.12 105.87,78.1 | D4.C 86.52,80.12 86.52,78.1 | D3.C 67.68,80.12 67.68,78.1 | D2.C 48.61,80.12 48.61,78.1 | D1.C 41,80.12 41,80.11 | 6.1,80.12 6.5,80.12 6.5,77.6 4.4,77.6 4.4,68.1 6.44,68.1 U1.PC7(#13)
ROW_1
  Bottom 0.152: U1.PD6(#12) 10.2,61.87 10.2,61.8 29.7,61.8 29.7,58.7 34.22,58.7 | 229.71,58.7 248.62,58.7 | 210.53,58.7 229.71,58.7 | 191.43,58.7 210.53,58.7 | 172.42,58.7 191.43,58.7 | 153.49,58.7 172.42,58.7 | 134.28,58.7 153.49,58.7 | 115.22,58.7 134.28,58.7 | 96.25,58.7 115.22,58.7 | 77.18,58.7 96.25,58.7 | 58.09,58.7 77.18,58.7 | 43.01,58.7 58.09,58.7 | 34.22,58.7 43.01,58.7 | 248.62,58.7 272.42,58.7 DDELETE.C | DRBRACKET.C 248.62,60.07 248.62,58.7 | DLBRACKET.C 229.71,60.07 229.71,58.7 | DP.C 210.53,60.07 210.53,58.7 | DO.C 191.43,60.07 191.43,58.7 | DI.C 172.42,60.07 172.42,58.7 | DU.C 153.49,60.07 153.49,58.7 | DY.C 134.28,60.07 134.28,58.7 | DT.C 115.22,60.07 115.22,58.7 | DR.C 96.25,60.07 96.25,58.7 | DE.C 77.18,60.07 77.18,58.7 | DW.C 58.09,60.07 58.09,58.7 | DQ.C 43.01,60.07 43.01,58.7 | DTAB.C 34.22,60.07 34.22,58.7
ROW_2  (via drill 0.35)
  Top 0.152: v4,52.6 4.9,52.6 v4.9,59.2
  Bottom 0.152: DCTRL.C 15.3,41.02 15.3,39.2 | 15.3,39.2 17.5,39.2 17.5,39.8 19.8,39.8 19.8,39.2 39.18,39.1 | 229.58,39.1 253.3,39.1 | 210.6,39.1 229.58,39.1 | 191.43,39.1 210.6,39.1 | 172.52,39.1 191.43,39.1 | 153.37,39.1 172.52,39.1 | 134.25,39.1 153.37,39.1 | 115.17,39.1 134.25,39.1 | 96.1,39.1 115.17,39.1 | 77.13,39.1 96.1,39.1 | 58.12,39.1 77.13,39.1 | 39.18,39.1 58.12,39.1 | 253.3,39.1 277.18,39.1 DPGUP.C | DENTER.C 253.3,41.02 253.3,39.1 | DQUOTE.C 229.58,41.02 229.58,39.1 | DSEMICOLON.C 210.6,41.02 210.6,39.1 | DL.C 191.43,41.02 191.43,39.1 | DK.C 172.52,41.02 172.52,39.1 | DJ.C 153.37,39.1 | DH.C 134.25,41.02 134.25,39.1 | DG.C 115.17,41.02 115.17,39.1 | DF.C 96.1,41.02 96.1,39.1 | DD.C 77.13,41.02 77.13,39.1 | DS.C 58.12,41.02 58.12,39.1 | DA.C 39.18,41.02 39.18,39.1 | 15.3,39.2 5,39.2 | 5,39.2 4.9,39.2 | U1.PB7(#11) | 5,39.2 4,39.2 v4,52.6 | v4.9,59.2 4.9,63.1 U1.PB7(#11)
ROW_3  (via drill 0.35)
  Top 0.152: v3.9,54.4 3.9,60.55 U1.PB6(#10)
  Bottom 0.152: DSHIFT.C 14,21.97 14,20 | 234.42,20 210.53,20 | 234.42,20 258.08,20 | 191.53,20 210.53,20 | 172.48,20 191.53,20 | 153.39,20 172.48,20 | 134.29,20 153.39,20 | 115.34,20 134.29,20 | 96.15,20 115.34,20 | 77.2,20 96.15,20 | 58.08,20 77.2,20 | 41.15,20 58.08,20 | 41.15,20 14,20 | 258.08,20 277.18,20 DPGDN.C | DUP.C 258.08,20 | DSLASH.C 210.53,21.97 210.53,20 | DSHIFT2.C 234.42,21.97 234.42,20 | DPERIOD.C 191.53,21.97 191.53,20 | DCOMMA.C 172.48,21.97 172.48,20 | DM.C 153.39,21.97 153.39,20 | DN.C 134.29,21.97 134.29,20 | DB.C 115.34,21.97 115.34,20 | DV.C 96.15,21.97 96.15,20 | DC.C 77.2,21.97 77.2,20 | DX.C 58.08,21.97 58.08,20 | DZ.C 41.15,20 | 14,20 2.6,20 2.6,54.4 v3.9,54.4
ROW_4
  Bottom 0.152: 13.9,2.92 DCAPSLOCK.C 13.86,1.5 14.09,1.5 | 35.21,1.5 54.29,1.5 | 14.09,1.5 35.21,1.5 | 14.09,1.5 13.9,1.5 | 54.29,1.5 66,1.5 66,6 75,6 75,1.6 85.32,1.6 | 85.32,1.6 90.1,1.6 90.1,5.9 99,5.9 99,1.6 116.22,1.6 | 116.22,1.6 135.34,1.6 | 135.34,1.6 147,1.6 147,6 156,6 156,1.5 166.26,1.5 | 166.26,1.5 171.1,1.5 171.1,6 180,6 180,1.5 197.24,1.5 | 240.04,1.5 259.24,1.5 | 218.65,1.5 240.04,1.5 | 197.24,1.5 218.65,1.5 | 259.24,1.5 278.18,1.5 DRIGHT.C | DDOWN.C 259.24,2.92 259.24,1.5 | DLEFT.C 240.04,2.92 240.04,1.5 | DALT2.C 218.65,1.5 | DSUPER.C 197.24,2.92 197.24,1.5 | DBACKSPACE.C 166.26,1.5 | DFN2.C 135.34,2.92 135.34,1.6 | DFN.C 116.22,2.92 116.22,1.6 | DSPACE.C 85.32,2.92 85.32,1.6 | DALT.C 54.29,2.92 54.29,1.5 | DWIN.C 35.21,2.92 35.21,1.5 | 14.1,1.5 14.09,1.5 | 14.09,1.5 1.8,1.5 1.8,58.01 U1.PB5(#9)
VCC  (via drill 0.35)
  Top 0.152: v28,41.2 22.2,41.2 22.2,83.3 26.38,83.3 26.49,83.19 26.76,83.19 U1.3V3
  Bottom 0.152: IC2.24 32.5,41.9 28,41.9 v28,41.2

### Text on the board
tPlace: RONIN_KEYBOARD | NICHOLAS_SADJOLI